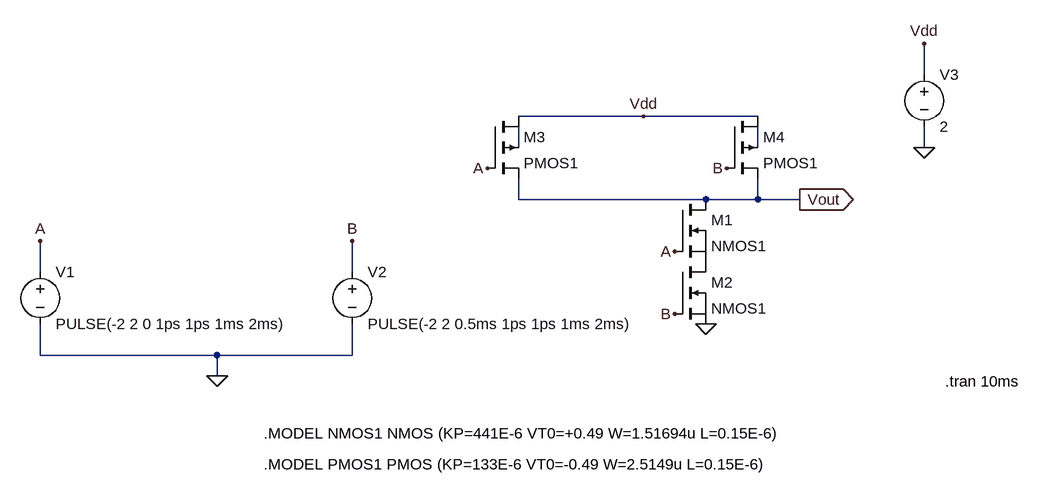
[diagram p0: schematic nand2.asc]
nand2.asc, the LTspice schematic file:
Version 4
SHEET 1 880 680
WIRE 672 -128 672 -176
WIRE 240 -64 48 -64
WIRE 416 -64 240 -64
WIRE 48 -16 48 -48
WIRE 416 -16 416 -48
WIRE 672 -16 672 -48
WIRE 48 64 48 32
WIRE 336 64 48 64
WIRE 416 64 416 32
WIRE 416 64 336 64
WIRE 480 64 416 64
WIRE -688 176 -688 128
WIRE -208 176 -208 128
WIRE -688 304 -688 256
WIRE -416 304 -688 304
WIRE -208 304 -208 256
WIRE -208 304 -416 304
WIRE -416 336 -416 304
FLAG 336 256 0
FLAG -688 128 A
FLAG 288 144 A
FLAG 0 16 A
FLAG -208 128 B
FLAG 288 240 B
FLAG 368 16 B
FLAG 672 -176 Vdd
FLAG 240 -64 Vdd
FLAG 480 64 Vout
IOPIN 480 64 Out
FLAG -416 336 0
FLAG 672 -16 0
SYMBOL nmos 288 64 R0
SYMATTR InstName M1
SYMATTR Value NMOS1
SYMBOL nmos 288 160 R0
SYMATTR InstName M2
SYMATTR Value NMOS1
SYMBOL pmos4 0 -64 R0
SYMATTR InstName M3
SYMATTR Value PMOS1
SYMBOL pmos4 368 -64 R0
SYMATTR InstName M4
SYMATTR Value PMOS1
SYMBOL voltage -688 160 R0
WINDOW 123 0 0 Left 0
WINDOW 39 0 0 Left 0
SYMATTR InstName V1
SYMATTR Value PULSE(-2 2 0 1ps 1ps 1ms 2ms)
SYMBOL voltage -208 160 R0
WINDOW 123 0 0 Left 0
WINDOW 39 0 0 Left 0
SYMATTR InstName V2
SYMATTR Value PULSE(-2 2 0.5ms 1ps 1ps 1ms 2ms)
SYMBOL voltage 672 -144 R0
WINDOW 123 0 0 Left 0
WINDOW 39 0 0 Left 0
SYMATTR InstName V3
SYMATTR Value 2
TEXT -344 424 Left 2 !.MODEL NMOS1 NMOS (KP=441E-6 VT0=+0.49 W=1.51694u L=0.15E-6)
TEXT -344 472 Left 2 !.MODEL PMOS1 PMOS (KP=133E-6 VT0=-0.49 W=2.5149u L=0.15E-6)
TEXT 704 344 Left 2 !.tran 10ms

The netlist it stands for:
* nand2.asc
M1 Vout A P001 P001 NMOS1
M2 P001 B 0 0 NMOS1
M3 Vdd A Vout N001 PMOS1
M4 Vdd B Vout N002 PMOS1
V1 A 0 PULSE(-2 2 0 1ps 1ps 1ms 2ms)
V2 B 0 PULSE(-2 2 0.5ms 1ps 1ps 1ms 2ms)
V3 Vdd 0 2
.model NMOS NMOS
.model PMOS PMOS
.lib standard.mos
.MODEL NMOS1 NMOS (KP=441E-6 VT0=+0.49 W=1.51694u L=0.15E-6)
.MODEL PMOS1 PMOS (KP=133E-6 VT0=-0.49 W=2.5149u L=0.15E-6)
.tran 10ms
.backanno
.end